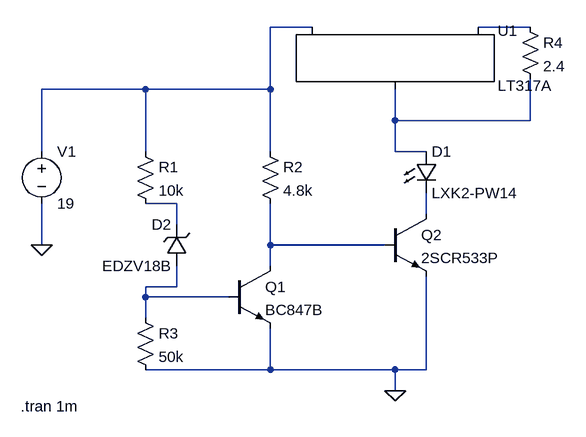
[diagram p0: schematic simulation 1.asc]
simulation 1.asc, the LTspice schematic file:
Version 4
SHEET 1 952 680
WIRE 432 -96 368 -96
WIRE 768 -96 688 -96
WIRE 176 0 16 0
WIRE 368 0 368 -96
WIRE 368 0 176 0
WIRE 560 48 560 0
WIRE 768 48 768 -16
WIRE 768 48 560 48
WIRE 16 96 16 0
WIRE 176 96 176 0
WIRE 368 96 368 0
WIRE 560 96 560 48
WIRE 608 96 560 96
WIRE 224 176 176 176
WIRE 608 192 608 160
WIRE 224 208 224 176
WIRE 16 240 16 176
WIRE 368 240 368 176
WIRE 544 240 368 240
WIRE 368 272 368 240
WIRE 224 304 224 272
WIRE 224 304 176 304
WIRE 176 320 176 304
WIRE 304 320 176 320
WIRE 176 352 176 320
WIRE 368 432 368 368
WIRE 368 432 176 432
WIRE 560 432 368 432
WIRE 608 432 608 288
WIRE 608 432 560 432
WIRE 560 464 560 432
FLAG 560 464 0
FLAG 16 240 0
SYMBOL voltage 16 80 R0
WINDOW 123 0 0 Left 0
WINDOW 39 0 0 Left 0
SYMATTR InstName V1
SYMATTR Value 19
SYMBOL npn 544 192 R0
SYMATTR InstName Q2
SYMATTR Value 2SCR533P
SYMBOL res 160 80 R0
SYMATTR InstName R1
SYMATTR Value 10k
SYMBOL res 352 80 R0
SYMATTR InstName R2
SYMATTR Value 4.8k
SYMBOL res 160 336 R0
SYMATTR InstName R3
SYMATTR Value 50k
SYMBOL npn 304 272 R0
SYMATTR InstName Q1
SYMATTR Value BC847B
SYMBOL LED 592 96 R0
SYMATTR InstName D1
SYMATTR Value LXK2-PW14
SYMBOL res 752 -112 R0
SYMATTR InstName R4
SYMATTR Value 2.4
SYMBOL zener 240 272 R180
WINDOW 0 24 64 Left 2
WINDOW 3 24 0 Left 2
SYMATTR InstName D2
SYMATTR Value EDZV18B
SYMBOL PowerProducts\\LT317A 560 -96 R0
SYMATTR InstName U1
TEXT -16 488 Left 2 !.tran 1m

The netlist it stands for:
* simulation 1.asc
V1 N001 0 19
Q2 N005 N006 0 0 2SCR533P
R1 N001 N004 10k
R2 N001 N006 4.8k
R3 N007 0 50k
Q1 N006 N007 0 0 BC847B
D1 N003 N005 LXK2-PW14
R4 N002 N003 2.4
D2 N007 N004 EDZV18B
XU1 N003 N002 N001 LT317A
.model D D
.lib standard.dio
.model NPN NPN
.model PNP PNP
.lib standard.bjt
.tran 1m
.lib LTC.lib
.backanno
.end